# EAGLE design teensy36-test-harness-7 (EAGLE 9.2.0)
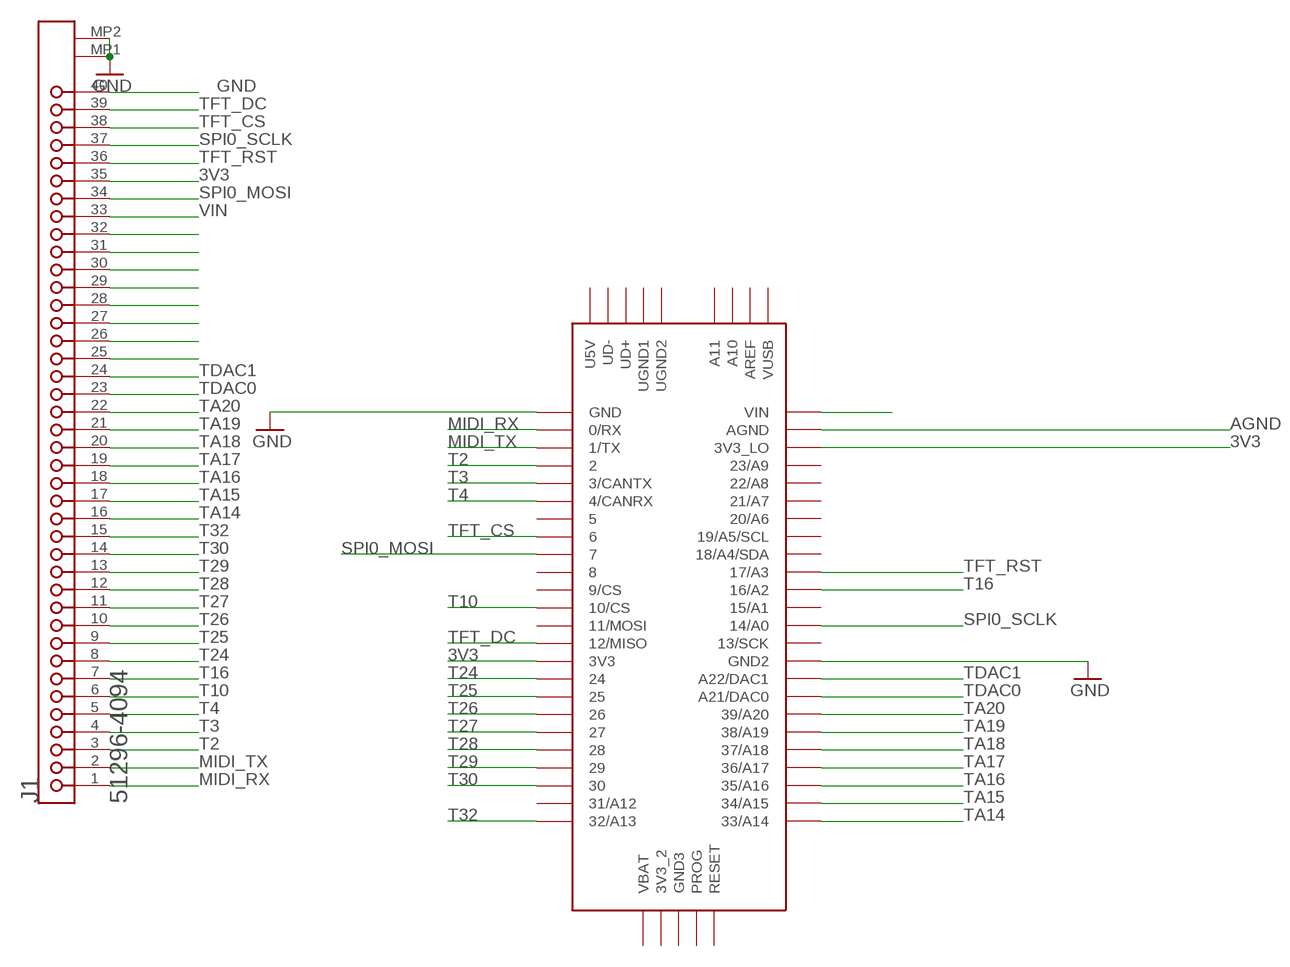
[diagram p0: schematic, sheet 1]

## Parts
J1  MOLEX_51296-4094MOLEX_51296-4094_0_0  [MOLEX_51296-4094_0]
U$3  TEENSY_3.5/3.6  [TEENSY_3.5/3.6]

## Nets
3V3: J1.35 U$3.3V3 U$3.3V3_LO
AGND: U$3.AGND
GND: J1.40 J1.MP1 J1.MP2 U$3.GND U$3.GND2
MIDI_RX: J1.1 U$3.0/RX
MIDI_TX: J1.2 U$3.1/TX
N$29: J1.25
N$30: J1.26
N$31: J1.27
N$32: J1.28
N$37: J1.29
N$38: J1.30
N$39: J1.31
N$40: J1.32
SPI0_MOSI: J1.34 U$3.7
SPI0_SCLK: J1.37 U$3.14/A0
T2: J1.3 U$3.2
T3: J1.4 U$3.3/CANTX
T4: J1.5 U$3.4/CANRX
T10: J1.6 U$3.10/CS
T16: J1.7 U$3.16/A2
T24: J1.8 U$3.24
T25: J1.9 U$3.25
T26: J1.10 U$3.26
T27: J1.11 U$3.27
T28: J1.12 U$3.28
T29: J1.13 U$3.29
T30: J1.14 U$3.30
T32: J1.15 U$3.32/A13
TA14: J1.16 U$3.33/A14
TA15: J1.17 U$3.34/A15
TA16: J1.18 U$3.35/A16
TA17: J1.19 U$3.36/A17
TA18: J1.20 U$3.37/A18
TA19: J1.21 U$3.38/A19
TA20: J1.22 U$3.39/A20
TDAC0: J1.23 U$3.21/DAC0(A21/DAC0)
TDAC1: J1.24 U$3.A22/DAC1
TFT_CS: J1.38 U$3.6
TFT_DC: J1.39 U$3.12/MISO
TFT_RST: J1.36 U$3.17/A3
VIN: J1.33 U$3.VIN
Unconnected: U$3.3V3_2 U$3.5 U$3.8 U$3.9/CS U$3.11/MOSI U$3.13/SCK U$3.15/A1 U$3.18/A4/SDA U$3.19/A5/SCL U$3.20/A6 U$3.21/A7 U$3.22/A8 U$3.23/A9 U$3.31/A12 U$3.A10 U$3.A11 U$3.AREF U$3.GND3 U$3.PROG U$3.RESET U$3.U5V U$3.UD+ U$3.UD- U$3.UGND1 U$3.UGND2 U$3.VBAT U$3.VUSB

## Library data of the parts
J1 = Molex - 51296-4094:MOLEX_51296-4094: MOLX-51296-4094; CIIVA_IDS: 1130028; CIRCUITS_LOADED: 40; COMPONENT_LINK_1_DESCRIPTION: Manufacturer URL; COMPONENT_LINK_1_URL: http://www.molex.com/molex/index.jsp; COMPONENT_LINK_3_DESCRIPTION: Package Specification; COMPONENT_LINK_3_URL: http://www.molex.com/pdm_docs/sd/512964094_sd.pdf; CONTACT_POSITION: Bottom; CURRENT_MAX_PER_CONTACT: 0.5A; DATASHEET: http://www.molex.com/webdocs/datasheets/pdf/en-us/0512964094_FFC_FPC_CONNECTORS.pdf; DURABILITY_MATING_CYCLES_MAX: 20; ENTRY_ANGLE: 90degrees Angle; FOOTPRINT_VARIANT_NAME_0: Manufacturer Recommended; IMPORTED: yes; IMPORTED_FROM: vault; IMPORT_TS: 1521847032; MATED_HEIGHT: 1.30mm; MATERIAL___METAL: Phosphor Bronze; MATERIAL___PLATING_MATING: Gold; MATERIAL___PLATING_TERMINATION: Gold; MF: Molex; MOUNTING_TECHNOLOGY: Surface Mount; MPN: 51296-4094; NUMBER_OF_ROWS: 1; ORIENTATION: Right Angle; PACKAGE: 51296-4094; PACKAGE_DESCRIPTION: 40-Lead FPC Connector, Pitch 0.5 mm; PACKAGE_VERSION: Rev. G, 02/2011; PACKING: Tape and Reel; PCB_LOCATOR: No; PCB_RETENTION: Yes; PITCH___MATING_INTERFACE: 0.50mm; POLARIZED_TO_PCB: Yes; PREFIX: J; RELEASE_DATE: 1411372364; ROHS: Yes; STACKABLE: No; VAULT_GUID: 4BA88983-4150-4A16-80A6-CA4AB2C51F99; VAULT_REVISION: D552042C-EB3A-4991-8013-6A4E9498D3CD; VOLTAGE_MAX: 50V AC (RMS)/DC
U$3 = JC_Teensy356:TEENSY_3.5/3.6

## Board
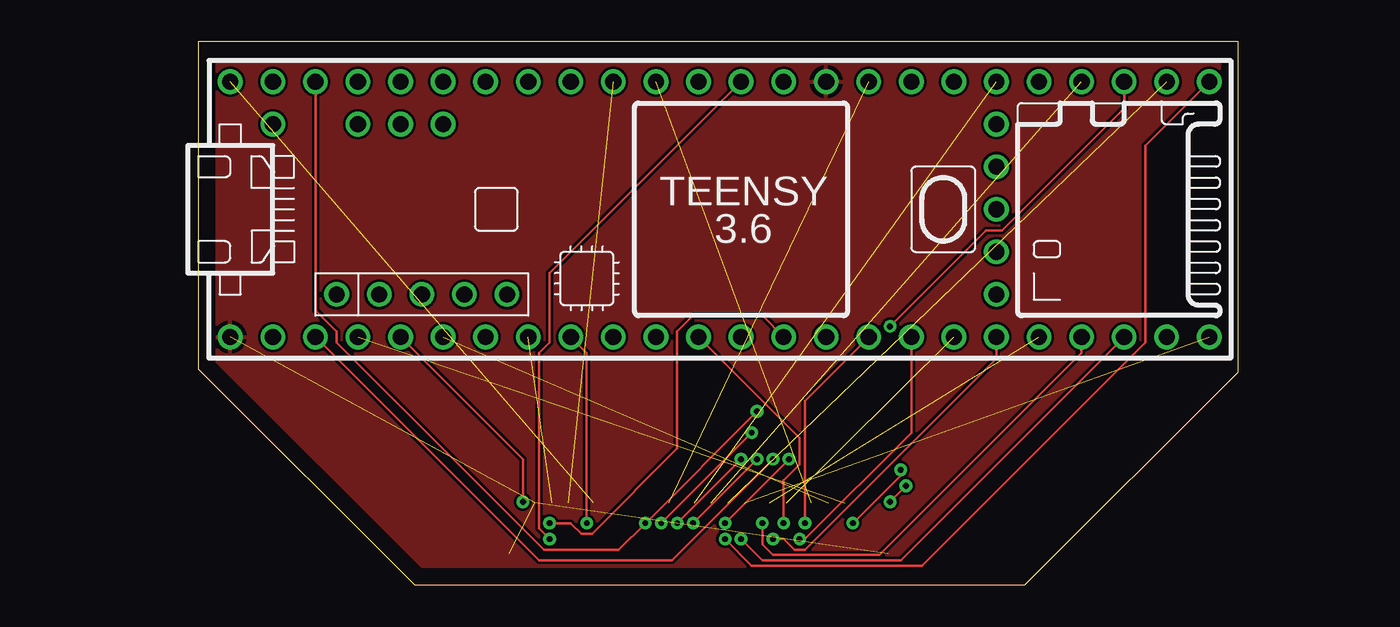
[diagram p1: board, top side]
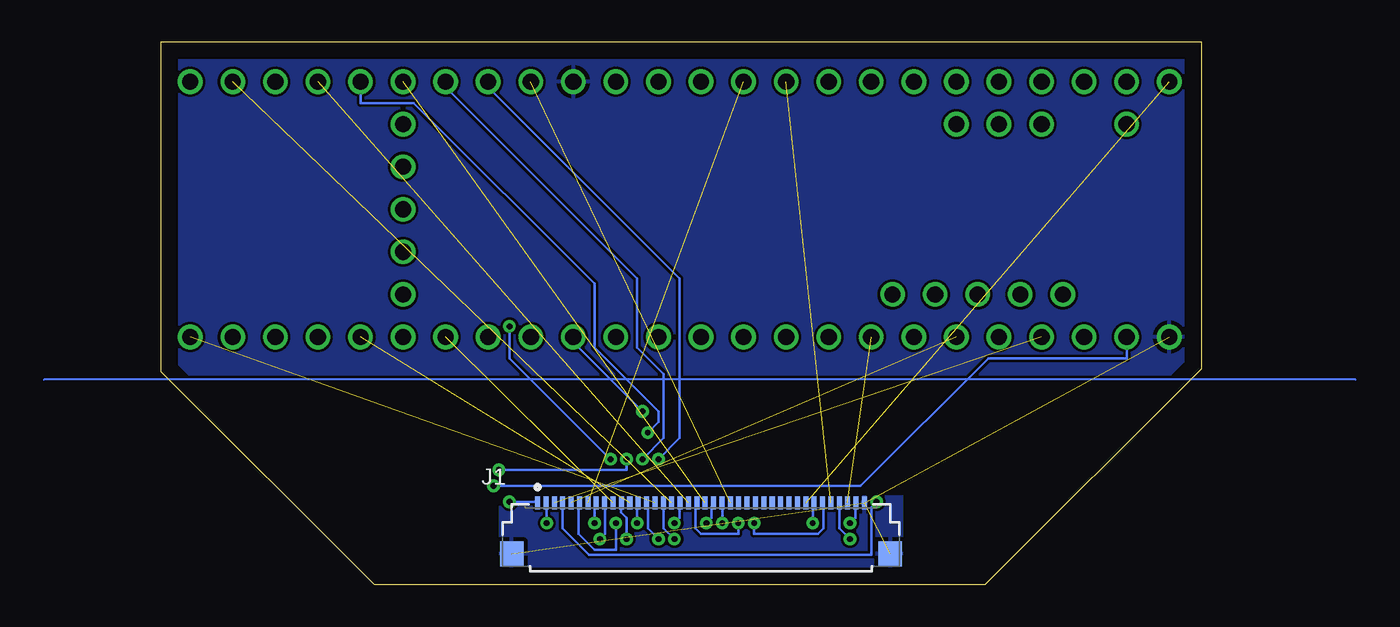
[diagram p2: board, bottom side, seen from below]

Size 62.06 x 32.42 mm. Coordinates in mm from the lower left corner, seen from the top.
Outline: 0,32.42 0,12.9 12.9,0 49.33,0 62.06,12.73 62.06,32.42 0,32.42
Copper layers (1*16): Top 0.035mm / dielectric 1.5mm / Bottom 0.035mm
Design rules "default": minimum track width 6mil, minimum drill 0.35mm, track to track 6mil, track to pad 6mil, pad to pad 6mil, via to via 6mil, smd to smd 6mil, copper to edge 40mil, drill to drill 6mil, minimum pad ring 10mil, minimum via ring 8mil, stop-mask expansion 4mil, vias tented up to drill 0mil, thermal gap 10mil

### Footprints (pad centres in the part's own frame; a part is rotated, then mirrored left to right if it is on the bottom)
MOLEX_51296-4094_0 = smd 0.3 x 0.8: 1 -9.75,1.525; 2 -9.25,1.525; 3 -8.75,1.525; 4 -8.25,1.525; 5 -7.75,1.525; 6 -7.25,1.525; 7 -6.75,1.525; 8 -6.25,1.525; 9 -5.75,1.525; 10 -5.25,1.525; 11 -4.75,1.525; 12 -4.25,1.525; 13 -3.75,1.525; 14 -3.25,1.525; 15 -2.75,1.525; 16 -2.25,1.525; 17 -1.75,1.525; 18 -1.25,1.525; 19 -0.75,1.525; 20 -0.25,1.525; 21 0.25,1.525; 22 0.75,1.525; 23 1.25,1.525; 24 1.75,1.525; 25 2.25,1.525; 26 2.75,1.525; 27 3.25,1.525; 28 3.75,1.525; 29 4.25,1.525; 30 4.75,1.525; 31 5.25,1.525; 32 5.75,1.525; 33 6.25,1.525; 34 6.75,1.525; 35 7.25,1.525; 36 7.75,1.525; 37 8.25,1.525; 38 8.75,1.525; 39 9.25,1.525; 40 9.75,1.525 | smd 1.4 x 1.5: MP1 -11.3,-1.525; MP2 11.3,-1.525
TEENSY_3.5/3.6 = drill 0.965: 0/RX -25.4,-7.62; 1/TX -22.86,-7.62; 2 -20.32,-7.62; 3/CANTX -17.78,-7.62; 3V3 7.62,-7.62; 3V3_2 17.78,-2.54; 3V3_LO -22.86,7.62; 4/CANRX -15.24,-7.62; 5 -12.7,-7.62; 6 -10.16,-7.62; 7 -7.62,-7.62; 8 -5.08,-7.62; 9/CS -2.54,-7.62; 10/CS 0,-7.62; 11/MOSI 2.54,-7.62; 12/MISO 5.08,-7.62; 13/SCK 5.08,7.62; 14/A0 2.54,7.62; 15/A1 0,7.62; 16/A2 -2.54,7.62; 17/A3 -5.08,7.62; 18/A4/SDA -7.62,7.62; 19/A5/SCL -10.16,7.62; 20/A6 -12.7,7.62; 21/A7 -15.24,7.62; 21/DAC0 12.7,7.62; 22/A8 -17.78,7.62; 23/A9 -20.32,7.62; 24 10.16,-7.62; 25 12.7,-7.62; 26 15.24,-7.62; 27 17.78,-7.62; 28 20.32,-7.62; 29 22.86,-7.62; 30 25.4,-7.62; 31/A12 27.94,-7.62; 32/A13 30.48,-7.62; 33/A14 30.48,7.62; 34/A15 27.94,7.62; 35/A16 25.4,7.62; 36/A17 22.86,7.62; 37/A18 20.32,7.62; 38/A19 17.78,7.62; 39/A20 15.24,7.62; A10 -17.78,5.08; A11 -15.24,5.08; A22/DAC1 10.16,7.62; AGND -25.4,7.62; AREF -20.32,5.08; GND -27.94,-7.62; GND2 7.62,7.62; GND3 17.78,0; PROG 17.78,2.54; RESET 17.78,5.08; U5V -21.59,-5.08; UD+ -16.51,-5.08; UD- -19.05,-5.08; UGND1 -13.97,-5.08; UGND2 -11.43,-5.08; VBAT 17.78,-5.08; VIN -27.94,7.62; VUSB -25.4,5.08

### Placement (x,y rotation side)
J1  29.84,3.37 0 bottom
U$3  29.84,22.42 0 top

### Tracks (layer width: path | path; a pad name or v marks a point on that pad's centre or on a via)
3V3  (via drill 0.35)
  Top 0.152: v33.33,10.36 v26.67,3.69 25.08,2.1 20.64,2.1 8.25,14.49 8.25,15.12 6.98,16.39 U$3.3V3_LO
  Bottom 0.152: v26.67,3.69 26.67,3.06 22.86,3.06 22.54,3.37 22.54,4.64 J1.35 | v33.33,10.36 37.46,14.49 U$3.3V3
GND  (3 unrouted)
  pour Top: -9.53,61.79 -9.53,14.8 -9.35,-27.1 79.28,-27.1 90.17,4.64 90.17,52.27 75.56,66.87 -4.45,66.87
  pour Bottom: -13.34,63.06 -8.26,68.14 75.56,68.14 88.9,54.81 88.9,5.37 80.06,-22.43 -5.4,-22.43 -13.34,13.53
MIDI_RX  (via drill 0.35)
  Top 0.152: v42.22,5.91 v41.27,4.96
  Bottom 0.152: v41.27,4.96 39.68,4.96 J1.1 | v42.22,5.91 20.32,5.91 12.7,13.53 4.44,13.53 U$3.0/RX
MIDI_TX  (via drill 0.35)
  Top 0.152: v39.05,3.69 41.91,6.55 v41.91,6.87 | v34.29,7.5 28.25,1.47 20.32,1.47 U$3.1/TX
  Bottom 0.152: v39.05,3.69 39.05,4.64 J1.2 | v41.91,6.87 34.29,6.87 v34.29,7.5
SPI0_MOSI  (via drill 0.35)
  Top 0.152: v23.18,3.69 23.18,13.85 U$3.7
  Bottom 0.152: v23.18,3.69 23.18,4.64 J1.34
SPI0_SCLK  (via drill 0.35)
  Top 0.152: v20.95,2.74 20.32,3.37 20.32,13.85 20.95,14.49 20.95,18.61 U$3.14/A0
  Bottom 0.152: v20.95,2.74 21.59,3.37 21.59,4.64 J1.37
T2  (1 unrouted)
T3  (via drill 0.35)
  Top 0.152: v19.36,4.96 19.36,7.5 U$3.3/CANTX
  Bottom 0.152: v19.36,4.96 19.68,4.64 19.68,1.79 36.51,1.79 38.1,3.37 38.1,4.64 J1.4
T4  (1 unrouted)
T10  (via drill 0.35)
  Top 0.152: v34.92,3.69 34.92,6.23 35.88,7.18 35.88,8.77 U$3.10/CS
  Bottom 0.152: v34.92,3.69 34.92,2.1 36.19,2.1 37.14,3.06 37.14,4.64 J1.6
T16  (1 unrouted)
T24  (via drill 0.35)
  Top 0.152: v36.19,3.69 36.19,10.99 U$3.24
  Bottom 0.152: v36.19,3.69 36.19,4.64 J1.8
T25  (via drill 0.35)
  Top 0.152: v35.88,2.74 36.19,2.74 42.54,9.09 U$3.25
  Bottom 0.152: v35.88,2.74 35.56,3.06 35.56,4.64 J1.9
T26  (1 unrouted)
T27  (via drill 0.35)
  Top 0.152: v34.29,2.74 34.92,2.74 35.56,2.1 36.19,2.1 47.62,13.53 U$3.27
  Bottom 0.152: v34.29,2.74 34.29,4.01 34.6,4.33 34.6,4.64 J1.11
T28  (1 unrouted)
T29  (via drill 0.35)
  Top 0.152: v33.65,3.69 33.65,2.42 34.29,1.79 40.64,1.79 52.7,13.85 U$3.29
  Bottom 0.152: v33.65,3.69 33.65,4.64 J1.13
T30  (via drill 0.35)
  Top 0.152: v32.38,2.74 33.65,1.47 41.91,1.47 U$3.30
  Bottom 0.152: v32.38,2.74 33.02,3.37 33.02,4.64 J1.14
T32  (1 unrouted)
TA14  (via drill 0.35)
  Top 0.152: v31.43,2.74 33.02,1.15 43.18,1.15 56.51,14.49 56.51,26.23 U$3.33/A14
  Bottom 0.152: v31.43,2.74 32.07,3.37 32.07,4.64 J1.16
TA15  (1 unrouted)
TA16  (via drill 0.35)
  Top 0.152: v35.24,7.5 v31.43,3.69 | v41.27,15.44 46.99,21.15 47.94,21.15 55.24,28.46 U$3.35/A16
  Bottom 0.152: v31.43,3.69 31.11,4.01 31.11,4.64 J1.18 | v35.24,7.5 41.27,13.53 v41.27,15.44
TA17  (1 unrouted)
TA18  (via drill 0.35)
  Top 0.152: v33.02,9.09 v27.62,3.69
  Bottom 0.152: v27.62,3.69 27.62,3.06 29.84,3.06 30.16,3.37 30.16,4.64 J1.20 | v33.02,9.09 32.38,9.72 32.38,10.36 36.19,14.17 36.19,17.98 46.99,28.77 50.16,28.77 U$3.37/A18
TA19  (1 unrouted)
TA20  (via drill 0.35)
  Top 0.152: v33.33,7.5 v29.53,3.69
  Bottom 0.152: v29.53,3.69 29.21,4.01 29.21,4.64 J1.22 | v33.33,7.5 32.07,8.77 32.07,12.58 33.65,14.17 33.65,18.3 45.08,29.73 U$3.39/A20
TDAC0  (via drill 0.35)
  Top 0.152: v32.38,7.5 v28.57,3.69
  Bottom 0.152: v28.57,3.69 28.57,4.64 J1.23 | v32.38,7.5 31.11,8.77 31.11,18.3 42.54,29.73 U$3.21/DAC0
TDAC1  (1 unrouted)
TFT_CS  (1 unrouted)
TFT_DC  (via drill 0.35)
  Top 0.152: v20.95,3.69 22.22,3.69 22.86,3.06 23.49,3.06 28.57,8.14 28.57,15.12 29.53,16.07 33.65,16.07 U$3.12/MISO
  Bottom 0.152: v20.95,3.69 20.64,4.01 20.64,4.64 J1.39
TFT_RST  (1 unrouted)
VIN  (1 unrouted)
(copper drawn outside any net)
  shapes: Bottom area x1

### Text on the board
tPlace: Analog IO